# Altium project projet_pcb_nucleo_g431.PrjPCB
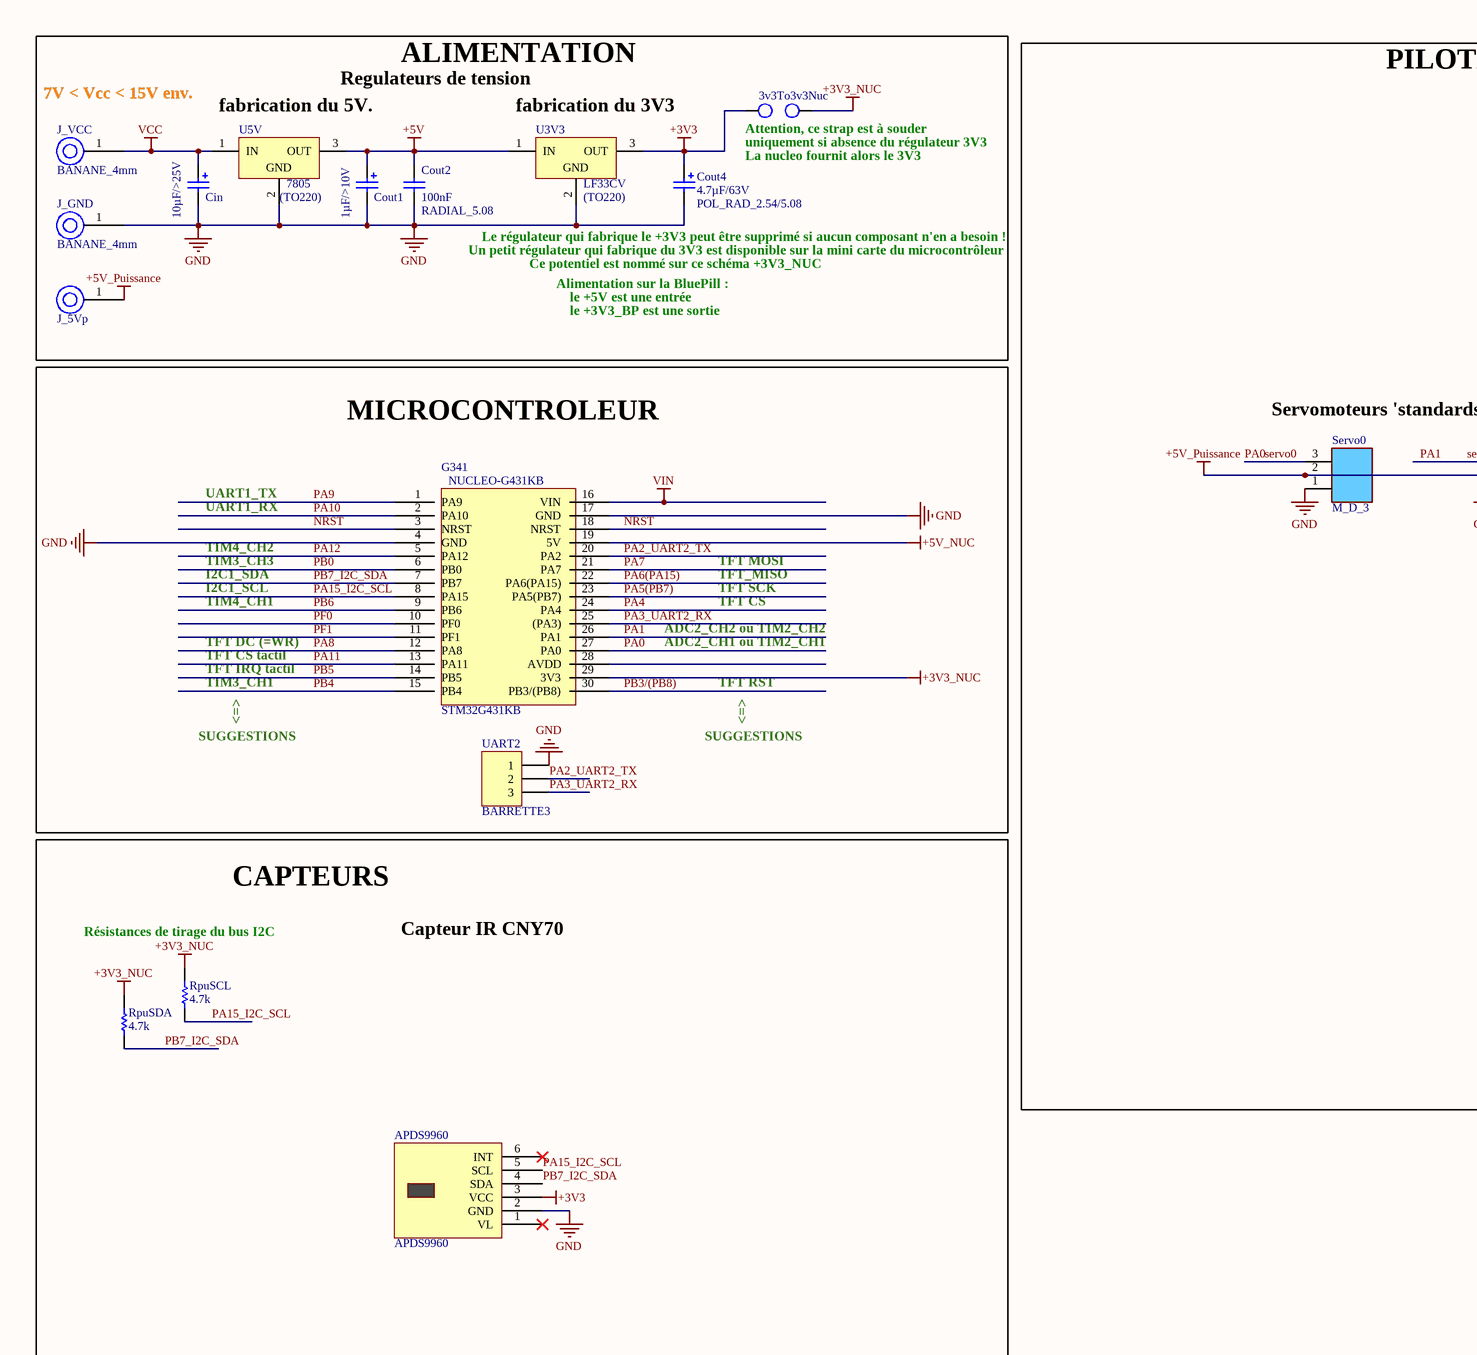
[diagram p0: projet_pcb_nucleo_g431.SchDoc, left]
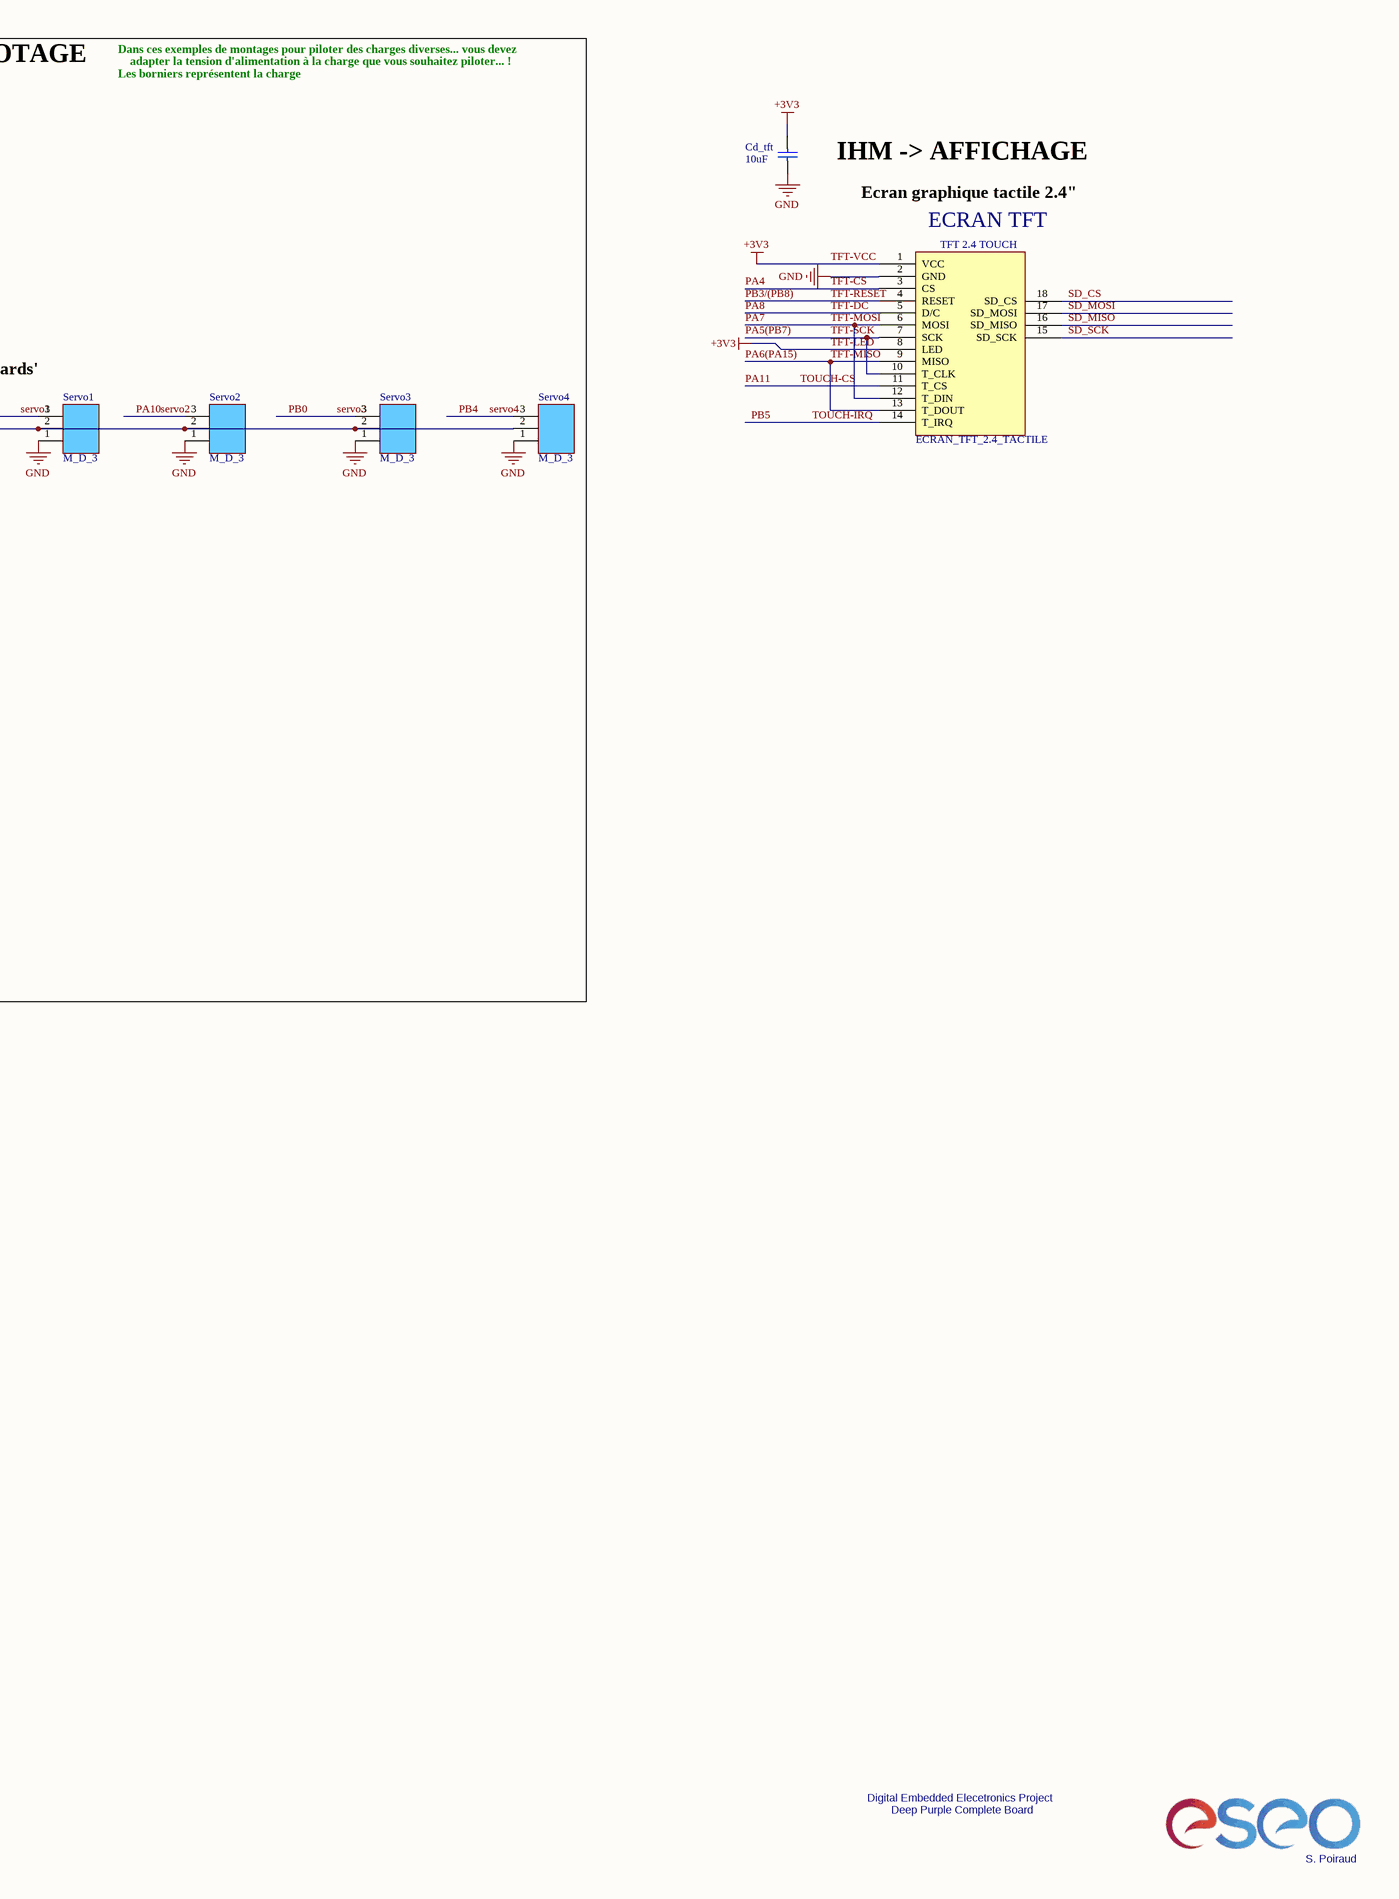
[diagram p1: projet_pcb_nucleo_g431.SchDoc, right]
1 sheet, 22 parts. Net scope: global (net labels, ports and power ports of the same name join across sheets).
Board file: projet_pcb_nucleo_g431.PCBDOC

## Sheet projet_pcb_nucleo_g431.SchDoc
size A2

### Parts
3v3To3v3Nuc  JUMPER2  [BARRETTE_2_M_D]  (value not drawn)
APDS9960  APDS9960  [APDS9960]
Cd_tft  10uF  [C0805_N]
Cin  value 10µF/>25V  [CONDENSATEUR_POLARISE_ELECTROLYTIQUE_RADIAL_2.0/5.08]  (hidden comment: CONDENSATEUR_POL_ELECTROLY_RAD_2.0/5.08)
Cout1  value 1µF/>10V  [CONDENSATEUR_POLARISE_ELECTROLYTIQUE_RADIAL_2.0/5.08]  (hidden comment: CONDENSATEUR_POL_ELECTROLY_RAD_2.0/5.08)
Cout2  value 100nF  Type: RADIAL_5.08  [CONDENSATEUR_CERAMIQUE_RADIAL_5.08]  (hidden comment: CONDENSATEUR_CER_RAD_5.08)
Cout4  value 4.7µF/63V  Type: POL_RAD_2.54/5.08  [CONDENSATEUR_POLARISE_ELECTROLYTIQUE_RADIAL_2.54/5.08]  (hidden comment: CONDENSATEUR_POL_ELECTROLY_RAD_2.54/5.08)
G341  STM32G431KB  [NUCLEO-G431KB]
J_5Vp  DOUILLE BANANE 4mm  [DOUILLE_BANANE_4mm]  (value not drawn)
J_GND  Type: BANANE_4mm  [DOUILLE_BANANE_4mm]  (hidden comment: DOUILLE BANANE 4mm)
J_VCC  Type: BANANE_4mm  [DOUILLE_BANANE_4mm]  (hidden comment: DOUILLE BANANE 4mm)
RpuSCL  value 4.7k  [R1206_N]  (hidden comment: RESISTANCE_CMS_1206)
RpuSDA  value 4.7k  [R1206_N]  (hidden comment: RESISTANCE_CMS_1206)
Servo0  Type: M_D_3  [BARRETTE_3_M_D]  (hidden comment: BARRETTE 3 CONTACTS 1 RANGEE MALE DROITE)
Servo1  Type: M_D_3  [BARRETTE_3_M_D]  (hidden comment: BARRETTE 3 CONTACTS 1 RANGEE MALE DROITE)
Servo2  Type: M_D_3  [BARRETTE_3_M_D]  (hidden comment: BARRETTE 3 CONTACTS 1 RANGEE MALE DROITE)
Servo3  Type: M_D_3  [BARRETTE_3_M_D]  (hidden comment: BARRETTE 3 CONTACTS 1 RANGEE MALE DROITE)
Servo4  Type: M_D_3  [BARRETTE_3_M_D]  (hidden comment: BARRETTE 3 CONTACTS 1 RANGEE MALE DROITE)
TFT1  ECRAN_TFT_2.4_TACTILE  [ECRAN_TFT_2.4_TACTILE]
U3V3  Type: LF33CV  Package: (TO220)  [REGULATEUR_TO220_78XX]  (hidden comment: REGULATEUR_TO220_78XX)
U5V  Type: 7805  Package: (TO220)  [REGULATEUR_TO220_78XX]  (hidden comment: REGULATEUR_TO220_78XX)
UART2  BARRETTE3  [HDR1X3]

### Blocks framed on the sheet
ALIMENTATION: 3v3To3v3Nuc Cin Cout1 Cout2 Cout4 J_5Vp J_GND J_VCC U3V3 U5V
PILOTAGE: Servo0-Servo4
MICROCONTROLEUR: G341 UART2
CAPTEURS: APDS9960 RpuSCL RpuSDA

### Nets
+3V3_NUC: 3v3To3v3Nuc.2 G341.29(3V3) RpuSCL.2 RpuSDA.2
+5V: Cout1.1 Cout2.2 U3V3.1(IN) U5V.3(OUT)
+5V_NUC: G341.19(5V)
+5V_Puissance: J_5Vp.1 Servo0.2 Servo1.2 Servo2.2 Servo3.2 Servo4.2
GND: APDS9960.2(GND) Cd_tft.1 Cin.2 Cout1.2 Cout2.1 Cout4.2 G341.4(GND) G341.17(GND) J_GND.1 Servo0.1 Servo1.1 Servo2.1 Servo3.1 Servo4.1 TFT1.2(GND) U3V3.2(GND) U5V.2(GND) UART2.1
TFT-LED: 3v3To3v3Nuc.1 APDS9960.3(VCC) Cd_tft.2 Cout4.1 TFT1.1(VCC) TFT1.8(LED) U3V3.3(OUT)  [also labelled +3V3, TFT-VCC]
VCC: Cin.1 J_VCC.1 U5V.1(IN)
VIN: G341.16(VIN)
NRST: G341.3(NRST) G341.18(NRST)
PA0: G341.27(PA0) Servo0.3  [also labelled servo0]
PA1: G341.26(PA1) Servo1.3  [also labelled servo1]
PA2_UART2_TX: G341.20(PA2) UART2.2
PA3_UART2_RX: G341.25((PA3)) UART2.3
PA4: G341.24(PA4) TFT1.3(CS)  [also labelled TFT-CS]
PA5(PB7): G341.23(PA5(PB7)) TFT1.7(SCK) TFT1.10(T_CLK)  [also labelled TFT-SCK]
PA6(PA15): G341.22(PA6(PA15)) TFT1.9(MISO) TFT1.13(T_DOUT)  [also labelled TFT-MISO]
PA7: G341.21(PA7) TFT1.6(MOSI) TFT1.12(T_DIN)  [also labelled TFT-MOSI]
PA8: G341.12(PA8) TFT1.5(D/C)  [also labelled TFT-DC]
PA9: G341.1(PA9)
PA10: G341.2(PA10) Servo2.3  [also labelled servo2]
PA11: G341.13(PA11) TFT1.11(T_CS)  [also labelled TOUCH-CS]
PA12: G341.5(PA12)
PA15_I2C_SCL: APDS9960.5(SCL) G341.8(PA15) RpuSCL.1
PB0: G341.6(PB0) Servo3.3  [also labelled servo3]
PB3/(PB8): G341.30(PB3/(PB8)) TFT1.4(RESET)  [also labelled TFT-RESET]
PB4: G341.15(PB4) Servo4.3  [also labelled servo4]
PB5: G341.14(PB5) TFT1.14(T_IRQ)  [also labelled TOUCH-IRQ]
PB6: G341.9(PB6)
PB7_I2C_SDA: APDS9960.4(SDA) G341.7(PB7) RpuSDA.1
PF0: G341.10(PF0)
PF1: G341.11(PF1)
SD_CS: TFT1.18(SD_CS)
SD_MISO: TFT1.16(SD_MISO)
SD_MOSI: TFT1.17(SD_MOSI)
SD_SCK: TFT1.15(SD_SCK)

Not connected (* = marked no-connect by the designer): APDS9960 1(VL)* 6(INT)*; G341 28(AVDD)

### Notes on the sheet
- 7V < Vcc < 15V env.
- (near U5V) fabrication du 5V.
- Regulateurs de tension
- (near U3V3) fabrication du 3V3
- Dans ces exemples de montages pour piloter des charges diverses... vous devez
- Les borniers représentent la charge
- adapter la tension d'alimentation à la charge que vous souhaitez piloter... !
- (near 3v3To3v3Nuc) Attention, ce strap est à souder
- (near 3v3To3v3Nuc) uniquement si absence du régulateur 3V3
- La nucleo fournit alors le 3V3
- Le régulateur qui fabrique le +3V3 peut être supprimé si aucun composant n'en a besoin !
- IHM -> AFFICHAGE
- Ecran graphique tactile 2.4"
- Un petit régulateur qui fabrique du 3V3 est disponible sur la mini carte du microcontrôleur
- Ce potentiel est nommé sur ce schéma +3V3_NUC
- Alimentation sur la BluePill :
- le +5V est une entrée
- (near TFT1) ECRAN TFT
- le +3V3_BP est une sortie
- Servomoteurs 'standards'
- UART1_TX
- UART1_RX
- TIM4_CH2
- TIM3_CH3
- I2C1_SDA
- TFT_MISO
- TFT MOSI
- TFT DC (=WR)
- TIM4_CH1
- I2C1_SCL
- ADC2_CH2 ou TIM2_CH2
- ADC2_CH1 ou TIM2_CH1
- TFT CS
- TFT SCK
- TFT CS tactil
- TFT IRQ tactil
- TIM3_CH1
- TFT RST
- SUGGESTIONS
- <=>
- (near RpuSCL) Résistances de tirage du bus I2C
- Capteur IR CNY70
- Digital Embedded Elecetronics Project
- Deep Purple Complete Board
- S. Poiraud
- Title
- Size:
- Date:
- File:
- A2
- Number:
- Time:
- Revision:
- Sheet
- of
- (in symbol ECRAN_TFT_2.4_TACTILE) TFT 2.4 TOUCH
- (in symbol G431_Nucleo) NUCLEO-G431KB

### Library data of the parts
3v3To3v3Nuc = JUMPER2: BARRETTE 2 CONTACTS 1 RANGEE MALE DROITE; Type: JUMPER2
Cd_tft = CONDENSATEUR_CMS_CER_0805: CONDENSATEUR CMS CERAMIQUE 0805; Value: 10µF; Type: Cd_tft
Cin Cout1 = CONDENSATEUR_POL_ELECTROLY_RAD_2.0/5.08: CONDENSATEUR POLARISE ELECTROLYTIQUE RADIAL 2.0/5.08; Type: POL_RAD_2.0/5.08
Cout2 = CONDENSATEUR_CER_RAD_5.08: CONDENSATEUR TRAVERSANT CERAMIQUE RADIAL 5.08mm
Cout4 = CONDENSATEUR_POL_ELECTROLY_RAD_2.54/5.08: CONDENSATEUR POLARISE ELECTROLYTIQUE RADIAL 2.54/5.08
G341 = G431_Nucleo: The STM32 Nucleo-32 board provides an affordable and flexible way for users to try out new concepts and build prototypes by choosing from the various combinations of performance and power consumption features, provided by the STM32 microcontroller.
J_5Vp J_GND J_VCC = DOUILLE_BANANE_4mm: DOUILLE BANANE 4 mm
  J_5Vp: Type: BANANE_4mm
RpuSCL RpuSDA = RESISTANCE_CMS_1206: RESISTANCE CMS 1206; Type: CMS_1206
Servo0-Servo4 = BARRETTE_3 CONTACTS_1 RANGEE_MALE_DROITE
U3V3 U5V = REGULATEUR_TO220_78XX: REGULATEUR DE TENSION POSITIVE 78XX BOITIER TO220
UART2 = BARRETTE3: Header, 3-Pin; LatestRevisionDate: 17-Jul-2002; LatestRevisionNote: Re-released for DXP Platform.; Publisher: Altium Limited